# EAGLE design io-hub-stm32 (EAGLE 5.10)
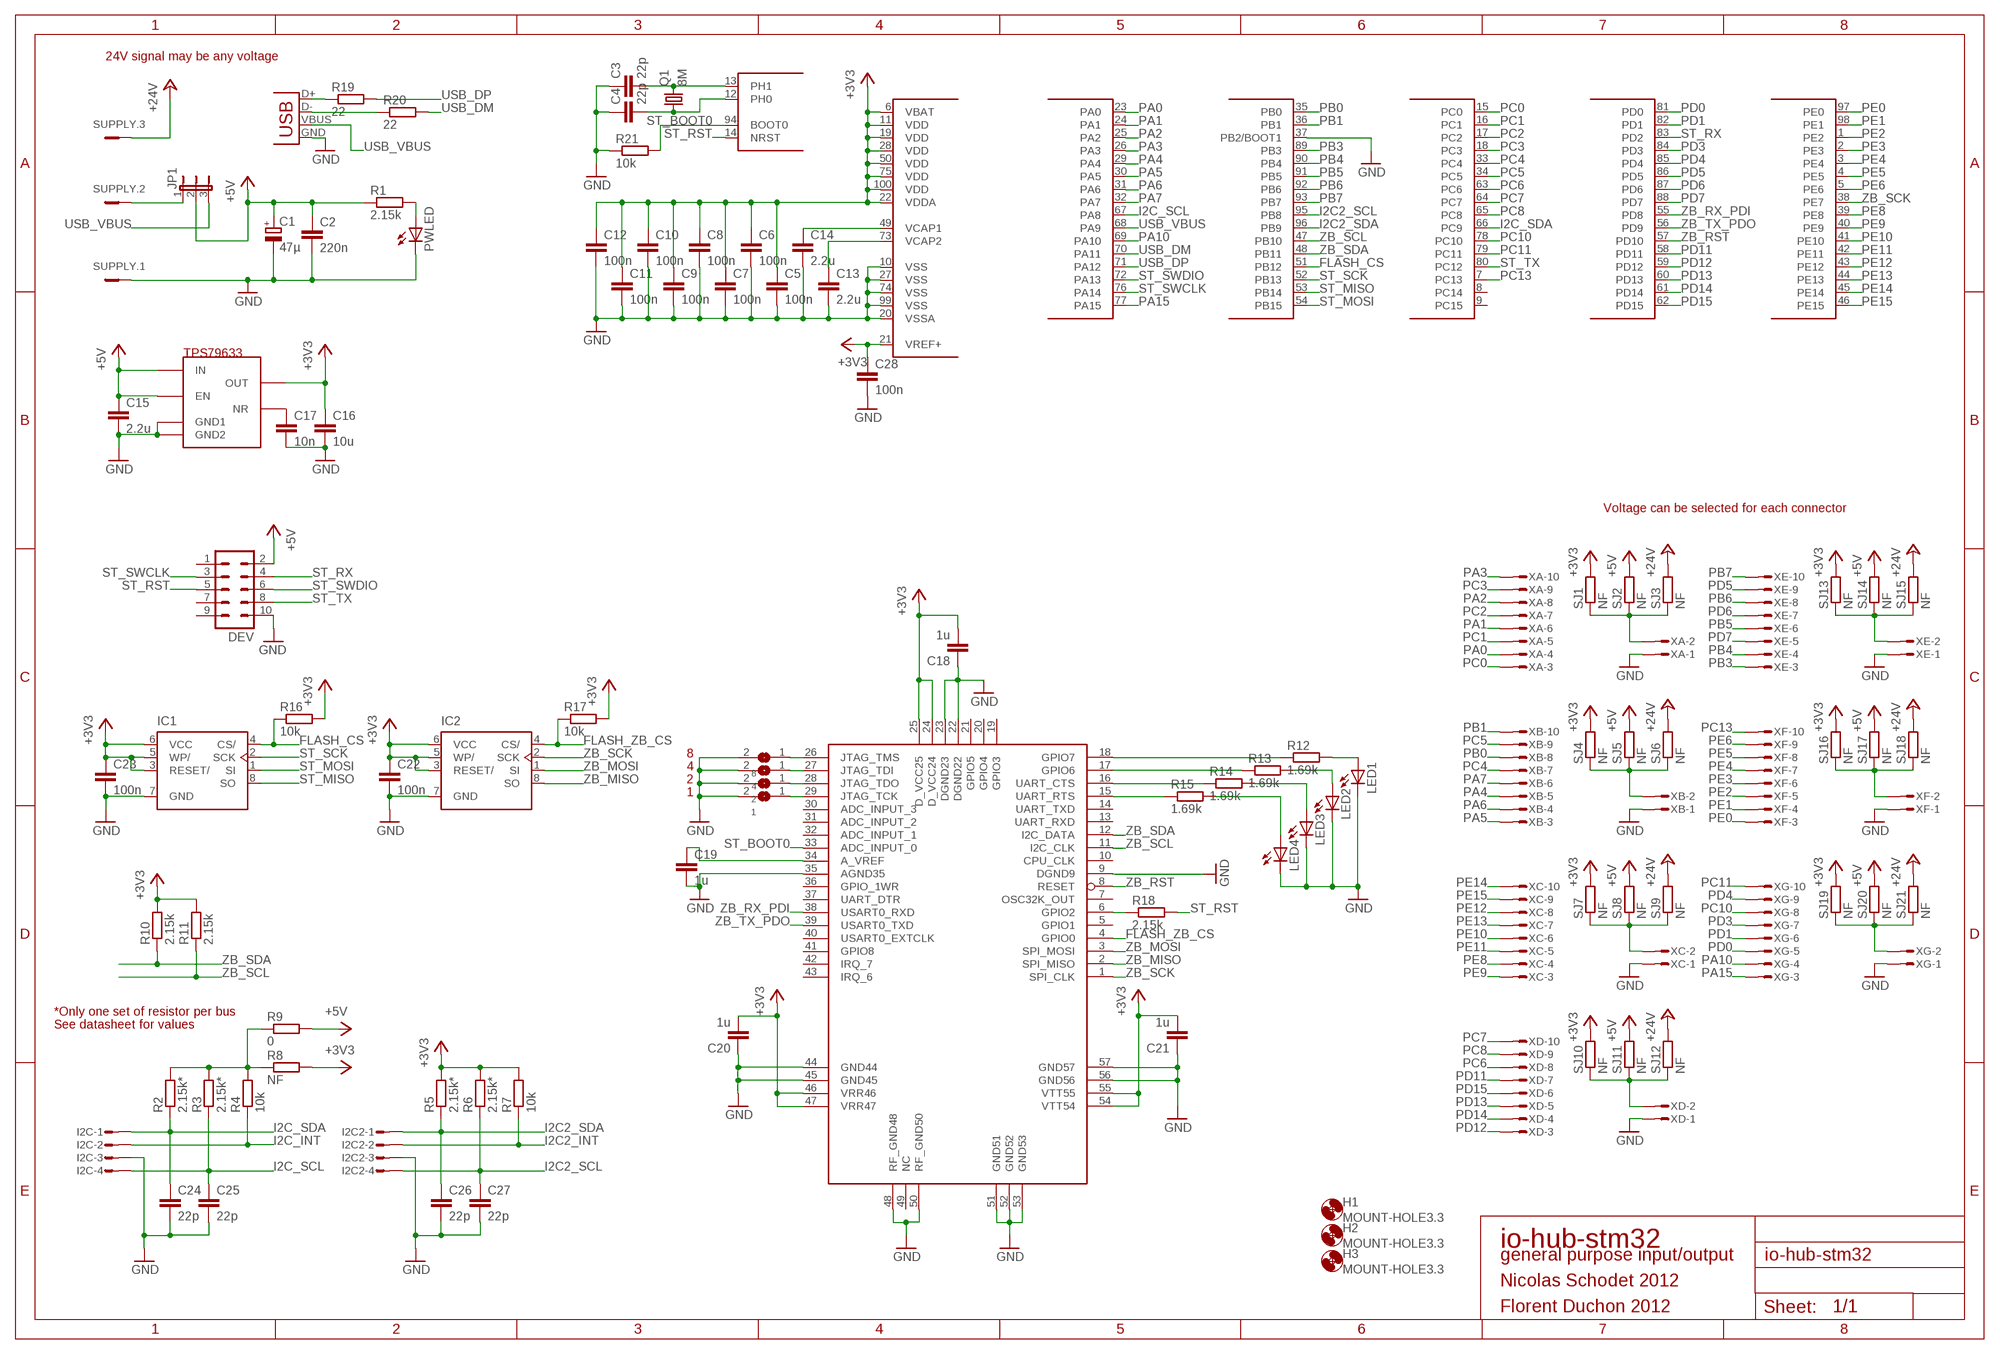
[diagram p0: schematic, sheet 1]

## Parts
1  SJ1SMD  [SJ1-SMD]
2  SJ1SMD  [SJ1-SMD]
4  SJ1SMD  [SJ1-SMD]
8  SJ1SMD  [SJ1-SMD]
C1  47µ  CPOL-EUC  [PANASONIC_C]
C2  220n  C-EUC0603  [C0603]
C3  22p  C-EUC0603  [C0603]
C4  22p  C-EUC0603  [C0603]
C5  100n  C-EUC0603  [C0603]
C6  100n  C-EUC0603  [C0603]
C7  100n  C-EUC0603  [C0603]
C8  100n  C-EUC0603  [C0603]
C9  100n  C-EUC0603  [C0603]
C10  100n  C-EUC0603  [C0603]
C11  100n  C-EUC0603  [C0603]
C12  100n  C-EUC0603  [C0603]
C13  2.2u  C-EUC0603  [C0603]
C14  2.2u  C-EUC0603  [C0603]
C15  2.2u  C-EUC0603  [C0603]
C16  10u  C-EUC0603  [C0603]
C17  10n  C-EUC0603  [C0603]
C18  1u  C-EUC0603  [C0603]
C19  1u  C-EUC0603  [C0603]
C20  1u  C-EUC0603  [C0603]
C21  1u  C-EUC0603  [C0603]
C22  100n  C-EUC0603  [C0603]
C23  100n  C-EUC0603  [C0603]
C24  22p  C-EUC0603  [C0603]
C25  22p  C-EUC0603  [C0603]
C26  22p  C-EUC0603  [C0603]
C27  22p  C-EUC0603  [C0603]
C28  100n  C-EUC0603  [C0603]
DEV  ML10L  [ML10L]
H1  MOUNT-HOLE3.3  [3,3]
H2  MOUNT-HOLE3.3  [3,3]
H3  MOUNT-HOLE3.3  [3,3]
I2C  MICROMATCH-4-SIDE  [MICROMATCH-4-SIDE]
I2C2  MICROMATCH-4-SIDE  [MICROMATCH-4-SIDE]
IC1  AT45DB  [SOIC8]
IC2  AT45DB  [SOIC8]
JP1  JP2E  [JP2]
LED1  LEDSMT1206  [1206]
LED2  LEDSMT1206  [1206]
LED3  LEDSMT1206  [1206]
LED4  LEDSMT1206  [1206]
PWLED  LEDSMT1206  [1206]
Q1  8M  QUARTZABM7  [ABM7]
R1  2.15k  R-EU_R0603  [R0603]
R2  2.15k*  R-EU_R0603  [R0603]
R3  2.15k*  R-EU_R0603  [R0603]
R4  10k  R-EU_R0603  [R0603]
R5  2.15k*  R-EU_R0603  [R0603]
R6  2.15k*  R-EU_R0603  [R0603]
R7  10k  R-EU_R0603  [R0603]
R8  NF  R-EU_R0603  [R0603]
R9  0  R-EU_R0603  [R0603]
R10  2.15k  R-EU_R0603  [R0603]
R11  2.15k  R-EU_R0603  [R0603]
R12  1.69k  R-EU_R0603  [R0603]
R13  1.69k  R-EU_R0603  [R0603]
R14  1.69k  R-EU_R0603  [R0603]
R15  1.69k  R-EU_R0603  [R0603]
R16  10k  R-EU_R0603  [R0603]
R17  10k  R-EU_R0603  [R0603]
R18  2.15k  R-EU_R0603  [R0603]
R19  22  R-EU_R0603  [R0603]
R20  22  R-EU_R0603  [R0603]
R21  10k  R-EU_R0603  [R0603]
SJ1  NF  R-EU_R0603  [R0603]
SJ2  NF  R-EU_R0603  [R0603]
SJ3  NF  R-EU_R0603  [R0603]
SJ4  NF  R-EU_R0603  [R0603]
SJ5  NF  R-EU_R0603  [R0603]
SJ6  NF  R-EU_R0603  [R0603]
SJ7  NF  R-EU_R0603  [R0603]
SJ8  NF  R-EU_R0603  [R0603]
SJ9  NF  R-EU_R0603  [R0603]
SJ10  NF  R-EU_R0603  [R0603]
SJ11  NF  R-EU_R0603  [R0603]
SJ12  NF  R-EU_R0603  [R0603]
SJ13  NF  R-EU_R0603  [R0603]
SJ14  NF  R-EU_R0603  [R0603]
SJ15  NF  R-EU_R0603  [R0603]
SJ16  NF  R-EU_R0603  [R0603]
SJ17  NF  R-EU_R0603  [R0603]
SJ18  NF  R-EU_R0603  [R0603]
SJ19  NF  R-EU_R0603  [R0603]
SJ20  NF  R-EU_R0603  [R0603]
SJ21  NF  R-EU_R0603  [R0603]
SUPPLY  MC3  [MC3]
U1  STM32F4-100-8MIL  [SQFP-S-14X14-100-8MIL]
U2  TPS79633  [SOT223-5]
U3  ATZB-24-UFLR  [ATZB-A24-UFLR]
USB  USB-MICROB-S  [USB-MICROB]
XA  MICROMATCH-10  [MICROMATCH-10]
XB  MICROMATCH-10  [MICROMATCH-10]
XC  MICROMATCH-10  [MICROMATCH-10]
XD  MICROMATCH-10  [MICROMATCH-10]
XE  MICROMATCH-10  [MICROMATCH-10]
XF  MICROMATCH-10  [MICROMATCH-10]
XG  MICROMATCH-10  [MICROMATCH-10]

## Nets
+3V3: C5.1 C6.1 C7.1 C8.1 C9.1 C10.1 C11.1 C12.1 C16.1 C18.2 C20.2 C21.2 C22.1 C23.1 C28.1 IC1.3(RESET/) IC1.5(WP/) IC1.6(VCC) IC2.3(RESET/) IC2.5(WP/) IC2.6(VCC) R5.2 R6.2 R7.2 R8.2 R10.2 R11.2 R16.2 R17.2 SJ1.2 SJ4.2 SJ7.2 SJ10.2 SJ13.2 SJ16.2 SJ19.2 U1.6(VBAT) U1.11(VDD) U1.19(VDD) U1.21(VREF+) U1.22(VDDA) U1.28(VDD) U1.50(VDD) U1.75(VDD) U1.100(VDD) U2.4(OUT) U3.24(D_VCC24) U3.25(D_VCC25) U3.46(VRR46) U3.47(VRR47) U3.54(VTT54) U3.55(VTT55)
+5V [supply]: C1.+ C2.1 C15.1 DEV.2 JP1.2 R1.1 R9.2 SJ2.2 SJ5.2 SJ8.2 SJ11.2 SJ14.2 SJ17.2 SJ20.2 U2.1(EN) U2.2(IN)
+24V: SJ3.2 SJ6.2 SJ9.2 SJ12.2 SJ15.2 SJ18.2 SJ21.2 SUPPLY.3
FLASH_CS: IC1.4(CS/) R16.1 U1.51(PB12)
FLASH_ZB_CS: IC2.4(CS/) R17.1 U3.4(GPIO0)
GND [supply]: 1.2 2.2 4.2 8.2 C1.- C2.2 C3.1 C4.1 C5.2 C6.2 C7.2 C8.2 C9.2 C10.2 C11.2 C12.2 C13.2 C14.2 C15.2 C16.2 C17.2 C18.1 C19.2 C20.1 C21.1 C22.2 C23.2 C24.2 C25.2 C26.2 C27.2 C28.2 DEV.10 I2C2.3 I2C.3 IC1.7(GND) IC2.7(GND) LED1.C LED2.C LED3.C LED4.C PWLED.C R21.1 SUPPLY.1 U1.10(VSS) U1.20(VSSA) U1.27(VSS) U1.37(PB2/BOOT1) U1.74(VSS) U1.99(VSS) U2.3(GND1) U2.6(GND2) U3.9(DGND9) U3.22(DGND22) U3.23(DGND23) U3.35(AGND35) U3.44(GND44) U3.45(GND45) U3.48(RF_GND48) U3.50(RF_GND50) U3.51(GND51) U3.52(GND52) U3.53(GND53) U3.56(GND56) U3.57(GND57) USB.GND XA.1 XB.1 XC.1 XD.1 XE.1 XF.1 XG.1
I2C2_INT: I2C2.2 R7.1
I2C2_SCL: C27.1 I2C2.4 R6.1 U1.95(PB8)
I2C2_SDA: C26.1 I2C2.1 R5.1 U1.96(PB9)
I2C_INT: I2C.2 R4.1
I2C_SCL: C25.1 I2C.4 R3.1 U1.67(PA8)
I2C_SDA: C24.1 I2C.1 R2.1 U1.66(PC9)
N$1: 8.1 U3.26(JTAG_TMS)
N$2: 4.1 U3.27(JTAG_TDI)
N$3: 2.1 U3.28(JTAG_TDO)
N$4: 1.1 U3.29(JTAG_TCK)
N$8: R2.2 R3.2 R4.2 R8.1 R9.1
NPWLED: PWLED.A R1.2
OSC_IN: C4.2 Q1.1 U1.12(PH0)
OSC_OUT: C3.2 Q1.2 U1.13(PH1)
PA0: U1.23(PA0) XA.4
PA1: U1.24(PA1) XA.6
PA2: U1.25(PA2) XA.8
PA3: U1.26(PA3) XA.10
PA4: U1.29(PA4) XB.5
PA5: U1.30(PA5) XB.3
PA6: U1.31(PA6) XB.4
PA7: U1.32(PA7) XB.6
PA10: U1.69(PA10) XG.4
PA15: U1.77(PA15) XG.3
PB0: U1.35(PB0) XB.8
PB1: U1.36(PB1) XB.10
PB3: U1.89(PB3) XE.3
PB4: U1.90(PB4) XE.4
PB5: U1.91(PB5) XE.6
PB6: U1.92(PB6) XE.8
PB7: U1.93(PB7) XE.10
PC0: U1.15(PC0) XA.3
PC1: U1.16(PC1) XA.5
PC2: U1.17(PC2) XA.7
PC3: U1.18(PC3) XA.9
PC4: U1.33(PC4) XB.7
PC5: U1.34(PC5) XB.9
PC6: U1.63(PC6) XD.8
PC7: U1.64(PC7) XD.10
PC8: U1.65(PC8) XD.9
PC10: U1.78(PC10) XG.8
PC11: U1.79(PC11) XG.10
PC13: U1.7(PC13) XF.10
PD0: U1.81(PD0) XG.5
PD1: U1.82(PD1) XG.6
PD3: U1.84(PD3) XG.7
PD4: U1.85(PD4) XG.9
PD5: U1.86(PD5) XE.9
PD6: U1.87(PD6) XE.7
PD7: U1.88(PD7) XE.5
PD11: U1.58(PD11) XD.7
PD12: U1.59(PD12) XD.3
PD13: U1.60(PD13) XD.5
PD14: U1.61(PD14) XD.4
PD15: U1.62(PD15) XD.6
PE0: U1.97(PE0) XF.3
PE1: U1.98(PE1) XF.4
PE2: U1.1(PE2) XF.5
PE3: U1.2(PE3) XF.6
PE4: U1.3(PE4) XF.7
PE5: U1.4(PE5) XF.8
PE6: U1.5(PE6) XF.9
PE8: U1.39(PE8) XC.4
PE9: U1.40(PE9) XC.3
PE10: U1.41(PE10) XC.6
PE11: U1.42(PE11) XC.5
PE12: U1.43(PE12) XC.8
PE13: U1.44(PE13) XC.7
PE14: U1.45(PE14) XC.10
PE15: U1.46(PE15) XC.9
ST_BOOT0: R21.2 U1.94(BOOT0) U3.33(ADC_INPUT_0)
ST_MISO: IC1.8(SO) U1.53(PB14)
ST_MOSI: IC1.1(SI) U1.54(PB15)
ST_RST: DEV.5 R18.2 U1.14(NRST)
ST_RX: DEV.4 U1.83(PD2)
ST_SCK: IC1.2(SCK) U1.52(PB13)
ST_SWCLK: DEV.3 U1.76(PA14)
ST_SWDIO: DEV.6 U1.72(PA13)
ST_TX: DEV.8 U1.80(PC12)
TO_ST_RST: R18.1 U3.6(GPIO2)
USB_DM: R20.2 U1.70(PA11)
USB_DMX: R20.1 USB.D-
USB_DP: R19.2 U1.71(PA12)
USB_DPX: R19.1 USB.D+
USB_VBUS: JP1.3 U1.68(PA9) USB.VBUS
VCAP1: C14.1 U1.49(VCAP1)
VCAP2: C13.1 U1.73(VCAP2)
VREG_NR: C17.1 U2.5(NR)
X5V: JP1.1 SUPPLY.2
XP1: SJ1.1 SJ2.1 SJ3.1 XA.2
XP2: SJ4.1 SJ5.1 SJ6.1 XB.2
XP3: SJ7.1 SJ8.1 SJ9.1 XC.2
XP4: SJ10.1 SJ11.1 SJ12.1 XD.2
XP5: SJ16.1 SJ17.1 SJ18.1 XF.2
XP6: SJ13.1 SJ14.1 SJ15.1 XE.2
XP7: SJ19.1 SJ20.1 SJ21.1 XG.2
ZB_AREF: C19.1 U3.34(A_VREF)
ZB_LED1: R12.1 U3.18(GPIO7)
ZB_LED1R: LED1.A R12.2
ZB_LED2: R13.1 U3.17(GPIO6)
ZB_LED2R: LED2.A R13.2
ZB_LED3: R14.1 U3.16(UART_CTS)
ZB_LED3R: LED3.A R14.2
ZB_LED4: R15.1 U3.15(UART_RTS)
ZB_LED4R: LED4.A R15.2
ZB_MISO: IC2.8(SO) U3.2(SPI_MISO)
ZB_MOSI: IC2.1(SI) U3.3(SPI_MOSI)
ZB_RST: U1.57(PD10) U3.8(RESET)
ZB_RX_PDI: U1.55(PD8) U3.38(USART0_RXD)
ZB_SCK: IC2.2(SCK) U1.38(PE7) U3.1(SPI_CLK)
ZB_SCL: R11.1 U1.47(PB10) U3.11(I2C_CLK)
ZB_SDA: R10.1 U1.48(PB11) U3.12(I2C_DATA)
ZB_TX_PDO: U1.56(PD9) U3.39(USART0_TXD)
Unconnected: DEV.1 DEV.7 DEV.9 U1.8(PC14) U1.9(PC15) U3.5(GPIO1) U3.7(OSC32K_OUT) U3.10(CPU_CLK) U3.13(UART_RXD) U3.14(UART_TXD) U3.19(GPIO3) U3.20(GPIO4) U3.21(GPIO5) U3.30(ADC_INPUT_3) U3.31(ADC_INPUT_2) U3.32(ADC_INPUT_1) U3.36(GPIO_1WR) U3.37(UART_DTR) U3.40(USART0_EXTCLK) U3.41(GPIO8) U3.42(IRQ_7) U3.43(IRQ_6) U3.49(NC)

## Notes on the sheet
- 24V signal may be any voltage
- Voltage can be selected for each connector
- 8
- 4
- 2
- 1
- *Only one set of resistor per bus
- See datasheet for values
- io-hub-stm32
- general purpose input/output
- Nicolas Schodet 2012
- Florent Duchon 2012

## Library data of the parts
1 2 4 8 = apbteam_jumper:SJ1: Jumper
C1 = rcl:CPOL-EU: POLARIZED CAPACITOR, European symbol
C2-C28 = rcl:C-EU: CAPACITOR, European symbol
DEV = con-harting-ml:ML10: HARTING
H1-H3 = holes:MOUNT-HOLE: MOUNTING HOLE with drill center marker
I2C I2C2 = apbteam_con-amp-micromatch:MICROMATCH-4: MicroMaTch 4
IC1 IC2 = ni-flash:AT45DB: AT45DB Atmel SPI data flash serie
JP1 = jumper:JP2E: JUMPER
LED1-LED4 PWLED = led:LED: LED OSRAM: - CHIPLED LG R971, LG N971, LY N971, LG Q971, LY Q971, LO R971, LY R971 LH N974, LH R974 LS Q976, LO Q976, LY Q976 LO Q996 - Hyper CHIPLED LW Q18S LB Q993, LB Q99A, LB R99A - SideLED LS A670, LO A670, LY A670, LG A670, LP A670 LB A673, LV A673, LT A673, LW A673 LH A674 LY A675 LS A676, LA A676, LO A676, LY A676, LW A676 LS A679, LY A679, LG A679 - Hyper Micro SIDELED® LS Y876, LA Y876, LO Y876, LY Y876 LT Y87S - SmartLED LW L88C, LW L88S LB L89C, LB L89S, LG L890 LS L89K, LO L89K, LY L89K LS L896, LA L896, LO L896, LY L896 - TOPLED LS T670, LO T670, LY T670, LG T670, LP T670 LSG T670, LSP T670, LSY T670, LOP T670, LYG T670 LG T671, LOG T671, LSG T671 LB T673, LV T673, LT T673, LW T673 LH T674 LS T676, LA T676, LO T676, LY T676, LB T676, LH T676, LSB T676, LW T676 LB T67C, LV T67C, LT T67C, LS T67K, LO T67K, LY T67K, LW E67C LS E67B, LA E67B, LO E67B, LY E67B, LB E67C, LV E67C, LT E67C LW T67C LS T679, LY T679, LG T679 LS T770, LO T770, LY T770, LG T770, LP T770 LB T773, LV T773, LT T773, LW T773 LH T774 LS E675, LA E675, LY E675, LS T675 LS T776, LA T776, LO T776, LY T776, LB T776 LHGB T686 LT T68C, LB T68C - Hyper Mini TOPLED® LB M676 - Mini TOPLED Santana® LG M470 LS M47K, LO M47K, LY M47K Source: http://www.osram.convergy.de - LUMILED® LXK2-PW12-R00, LXK2-PW12-S00, LXK2-PW14-U00, LXK2-PW14-V00 LXK2-PM12-R00, LXK2-PM12-S00, LXK2-PM14-U00 LXK2-PE12-Q00, LXK2-PE12-R00, LXK2-PE12-S00, LXK2-PE14-T00, LXK2-PE14-U00 LXK2-PB12-K00, LXK2-PB12-L00, LXK2-PB12-M00, LXK2-PB14-N00, LXK2-PB14-P00, LXK2-PB14-Q00 LXK2-PR12-L00, LXK2-PR12-M00, LXK2-PR14-Q00, LXK2-PR14-R00 LXK2-PD12-Q00, LXK2-PD12-R00, LXK2-PD12-S00 LXK2-PH12-R00, LXK2-PH12-S00 LXK2-PL12-P00, LXK2-PL12-Q00, LXK2-PL12-R00 Source: www.luxeon.com
Q1 = ni-crystal:QUARTZ
R1-R21 SJ1-SJ21 = apbteam_rcl:R-EU_: RESISTOR, European symbol
SUPPLY = con-phoenix-381_l:MC3: Mini-Combicon 3.81mm horizontal 3-polig MC 1,5/3-G-3,81 Artikel-Nr. 1803280
U1 = apbteam_stm32:STM32F4-100: STM32F4, 100 pin package According to STM32F40x datasheet, almost compatible with STM32F4xx, STM32F2xx, some pins must be connected differently, see chapter 2.1.
U2 = zigbit:TPS79633
U3 = apbteam_zigbit:ATZB-24-UFLR: ATZB-24-UFLR Package (External Antenna / UFLR connector) Created by florent@duchon.cc
USB = apbteam_con-usb:USB: USB Connectors
XA XB XC XD XE XF XG = apbteam_con-amp-micromatch:MICROMATCH-10: MicroMaTch 10

## Net classes
1 supply: width 0.254 mm

## Board
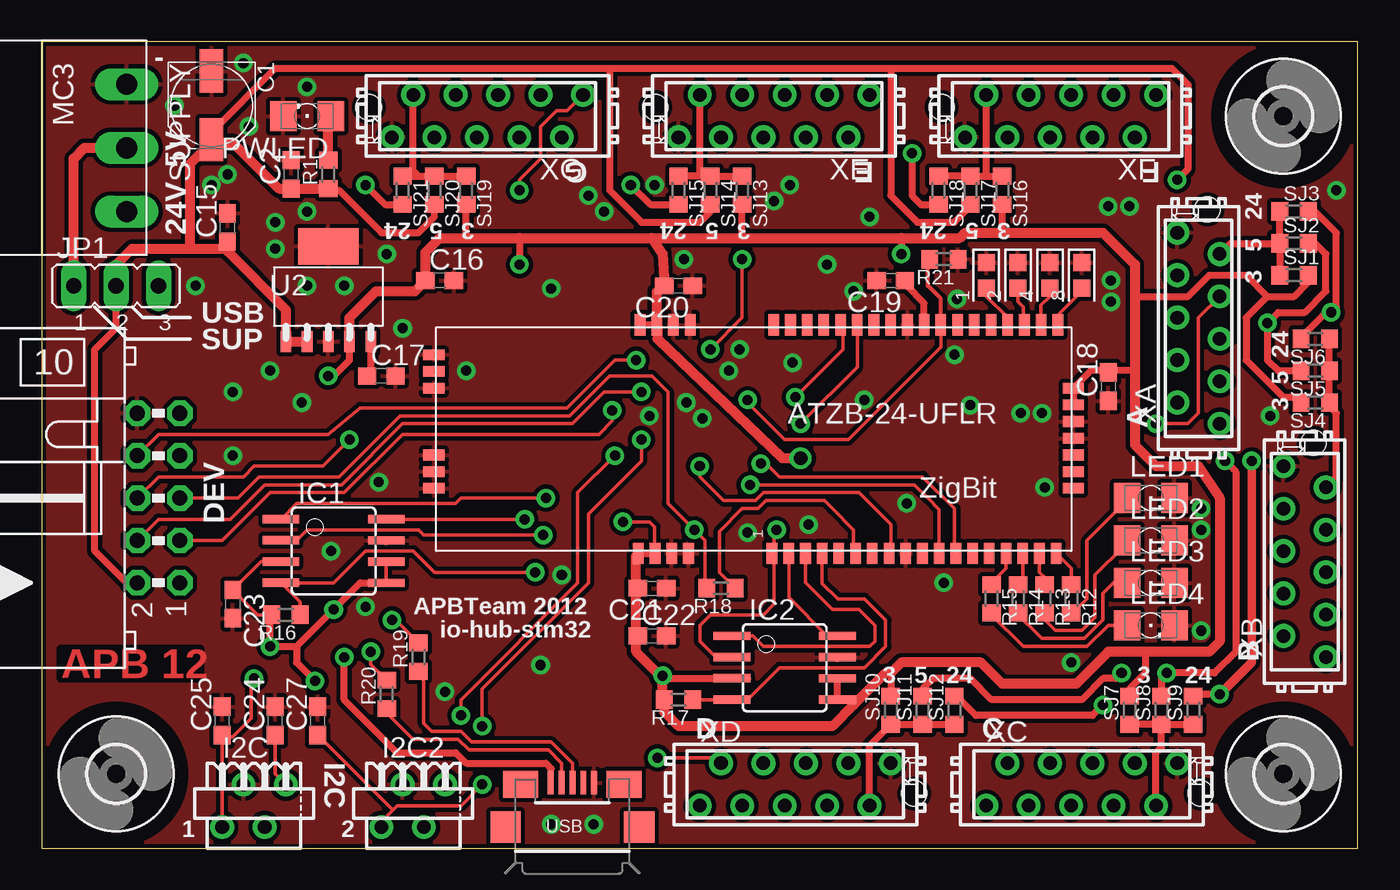
[diagram p1: board, top side]
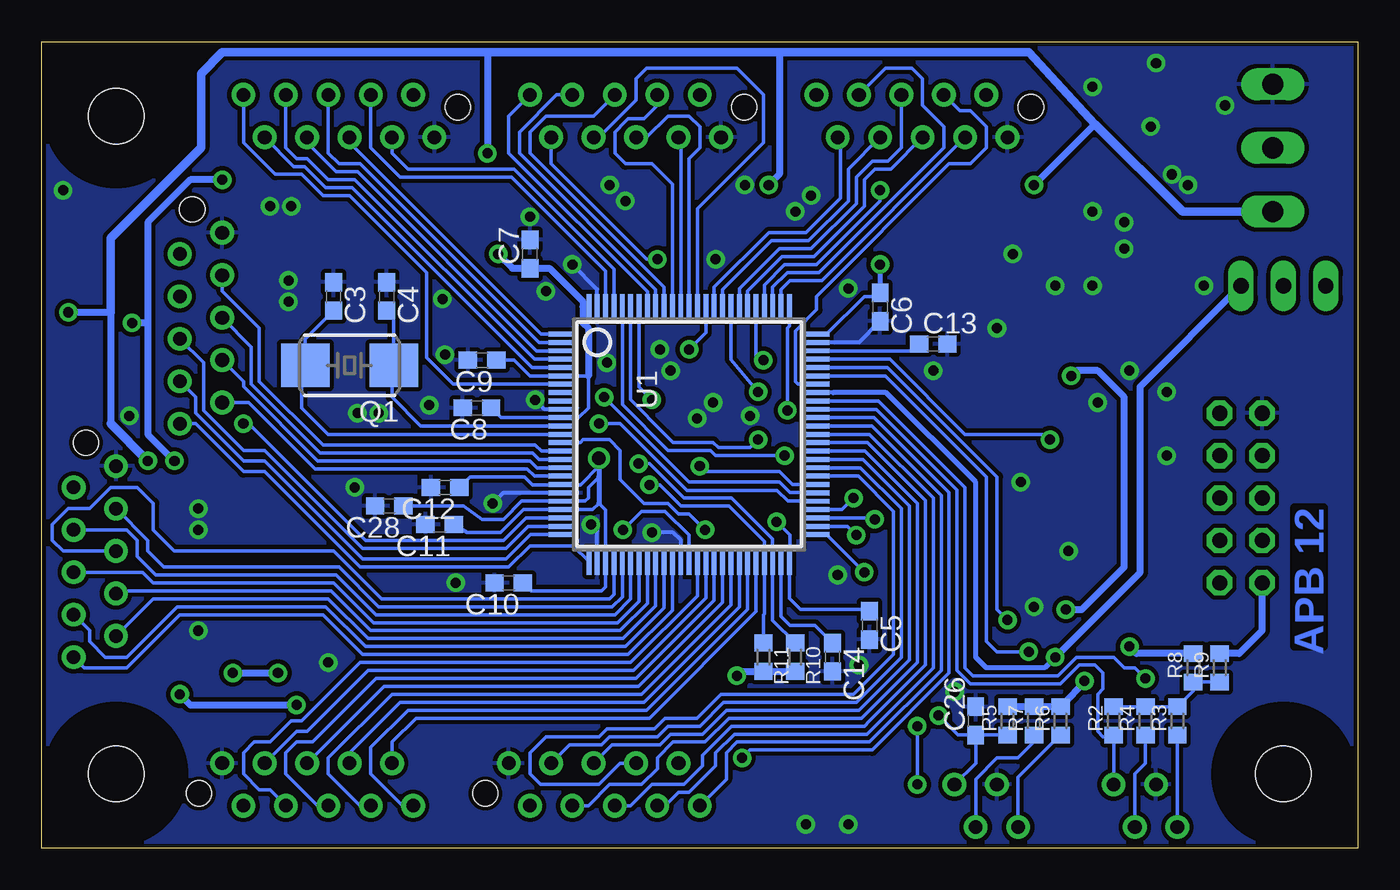
[diagram p2: board, bottom side, seen from below]

Size 78.74 x 48.26 mm. Coordinates in mm from the lower left corner, seen from the top.
Outline: 0,0 78.74,0 78.74,48.26 0,48.26 0,0
Copper layers (1*16): Top 0.035mm / dielectric 1.5mm / Bottom 0.035mm
Design rules "SparkFun": minimum track width 8mil, minimum drill 20mil, track to track 8mil, track to pad 8mil, pad to pad 8mil, via to via 8mil, smd to smd 8mil, copper to edge 10mil, drill to drill 8mil, minimum pad ring 12mil, minimum via ring 10mil, stop-mask expansion 4mil, vias tented up to drill 25mil, thermal gap 10mil

### Footprints (pad centres in the part's own frame; a part is rotated, then mirrored left to right if it is on the bottom)
SJ1-SMD = smd 1.016 x 1.016: 1 0.762,0; 2 -0.762,0
PANASONIC_C = smd 2.6 x 1.4: + 2.05,0; - -2.05,0
C0603 = smd 1.1 x 1: 1 -0.85,0; 2 0.85,0
ML10L = drill 0.914 octagon: 1 -5.08,-1.27; 2 -5.08,1.27; 3 -2.54,-1.27; 4 -2.54,1.27; 5 0,-1.27; 6 0,1.27; 7 2.54,-1.27; 8 2.54,1.27; 9 5.08,-1.27; 10 5.08,1.27
3,3 = hole 3.3: 0,0
MICROMATCH-4-SIDE = drill 0.813 round: 1 1.905,1.27; 2 0.635,-1.27; 3 -0.635,1.27; 4 -1.905,-1.27
SOIC8 = smd 0.5 x 2.2: 1 -1.905,-3.154; 2 -0.645,-3.154; 3 0.625,-3.154; 4 1.895,-3.154; 5 1.905,3.154; 6 0.635,3.154; 7 -0.635,3.154; 8 -1.905,3.154
JP2 = drill 0.914 long: 1 -2.54,0; 2 0,0; 3 2.54,0
1206 = smd 1.6 x 1.803: A -1.422,0; C 1.422,0
ABM7 = smd 2.9 x 2.6: 1 -2.65,0; 2 2.65,0
R0603 = smd 1 x 1.1: 1 -0.85,0; 2 0.85,0
MC3 = drill 1.27 long: 1 -3.81,0; 2 0,0; 3 3.81,0
SQFP-S-14X14-100-8MIL = smd 0.295 x 1.6: 1 -6,-7.6; 2 -5.5,-7.6; 3 -5,-7.6; 4 -4.5,-7.6; 5 -4,-7.6; 6 -3.5,-7.6; 7 -3,-7.6; 8 -2.5,-7.6; 9 -2,-7.6; 10 -1.5,-7.6; 11 -1,-7.6; 12 -0.5,-7.6; 13 0,-7.6; 14 0.5,-7.6; 15 1,-7.6; 16 1.5,-7.6; 17 2,-7.6; 18 2.5,-7.6; 19 3,-7.6; 20 3.5,-7.6; 21 4,-7.6; 22 4.5,-7.6; 23 5,-7.6; 24 5.5,-7.6; 25 6,-7.6; 51 6,7.6; 52 5.5,7.6; 53 5,7.6; 54 4.5,7.6; 55 4,7.6; 56 3.5,7.6; 57 3,7.6; 58 2.5,7.6; 59 2,7.6; 60 1.5,7.6; 61 1,7.6; 62 0.5,7.6; 63 0,7.6; 64 -0.5,7.6; 65 -1,7.6; 66 -1.5,7.6; 67 -2,7.6; 68 -2.5,7.6; 69 -3,7.6; 70 -3.5,7.6; 71 -4,7.6; 72 -4.5,7.6; 73 -5,7.6; 74 -5.5,7.6; 75 -6,7.6 | smd 1.6 x 0.295: 26 7.6,-6; 27 7.6,-5.5; 28 7.6,-5; 29 7.6,-4.5; 30 7.6,-4; 31 7.6,-3.5; 32 7.6,-3; 33 7.6,-2.5; 34 7.6,-2; 35 7.6,-1.5; 36 7.6,-1; 37 7.6,-0.5; 38 7.6,0; 39 7.6,0.5; 40 7.6,1; 41 7.6,1.5; 42 7.6,2; 43 7.6,2.5; 44 7.6,3; 45 7.6,3.5; 46 7.6,4; 47 7.6,4.5; 48 7.6,5; 49 7.6,5.5; 50 7.6,6; 76 -7.6,6; 77 -7.6,5.5; 78 -7.6,5; 79 -7.6,4.5; 80 -7.6,4; 81 -7.6,3.5; 82 -7.6,3; 83 -7.6,2.5; 84 -7.6,2; 85 -7.6,1.5; 86 -7.6,1; 87 -7.6,0.5; 88 -7.6,0; 89 -7.6,-0.5; 90 -7.6,-1; 91 -7.6,-1.5; 92 -7.6,-2; 93 -7.6,-2.5; 94 -7.6,-3; 95 -7.6,-3.5; 96 -7.6,-4; 97 -7.6,-4.5; 98 -7.6,-5; 99 -7.6,-5.5; 100 -7.6,-6
SOT223-5 = smd 0.635 x 1.27: 1 -2.54,-2.7; 2 -1.27,-2.7; 3 0,-2.7; 4 1.27,-2.7; 5 2.54,-2.7 | smd 3.6 x 2.2: 6 0,3
ATZB-A24-UFLR = smd 0.635 x 1.27: 1 17.9,0.135; 2 16.9,0.135; 3 15.9,0.135; 4 14.9,0.135; 5 13.9,0.135; 6 12.9,0.135; 7 11.9,0.135; 8 10.9,0.135; 9 9.9,0.135; 10 8.9,0.135; 11 7.9,0.135; 12 6.9,0.135; 13 5.9,0.135; 14 4.9,0.135; 15 3.9,0.135; 16 2.9,0.135; 17 1.9,0.135; 18 0.9,0.135; 26 0.8,-13.535; 27 1.8,-13.535; 28 2.8,-13.535; 29 3.8,-13.535; 30 4.8,-13.535; 31 5.8,-13.535; 32 6.8,-13.535; 33 7.8,-13.535; 34 8.8,-13.535; 35 9.8,-13.535; 36 10.8,-13.535; 37 11.8,-13.535; 38 12.8,-13.535; 39 13.8,-13.535; 40 14.8,-13.535; 41 15.8,-13.535; 42 16.8,-13.535; 43 17.8,-13.535; 44 22.8,-13.535; 45 23.8,-13.535; 46 24.8,-13.535; 47 25.8,-13.535; 54 25.9,0.135; 55 24.9,0.135; 56 23.9,0.135; 57 22.9,0.135 | smd 1.27 x 0.635: 19 -0.135,-3.75; 20 -0.135,-4.75; 21 -0.135,-5.75; 22 -0.135,-6.75; 23 -0.135,-7.75; 24 -0.135,-8.75; 25 -0.135,-9.75; 48 38.135,-11.75; 49 38.135,-10.75; 50 38.135,-9.75; 51 38.135,-5.75; 52 38.135,-4.75; 53 38.135,-3.75
USB-MICROB = smd 0.35 x 1.4: D+ 0,2.65; D- -0.65,2.65; GND 1.3,2.65; ID 0.65,2.65; VBUS -1.3,2.65 | smd 1.8 x 1.9: MT1 -4,0; MT2 4,0 | smd 2.1 x 1.6: MT3 -3.1,2.55; MT4 3.1,2.55
MICROMATCH-10 = drill 0.813 round: 1 5.715,1.27; 2 4.445,-1.27; 3 3.175,1.27; 4 1.905,-1.27; 5 0.635,1.27; 6 -0.635,-1.27; 7 -1.905,1.27; 8 -3.175,-1.27; 9 -4.445,1.27; 10 -5.715,-1.27 | hole 1.5: 7.11,-0.53

### Placement (x,y rotation side)
1  56.52,34.29 270 top
2  58.42,34.29 270 top
4  60.33,34.29 270 top
8  62.23,34.29 270 top
C1  10.16,44.45 270 top
C2  14.92,40.32 90 top
C3  61.28,33.02 270 bottom
C4  58.1,33.02 270 bottom
C5  29.21,13.34 270 bottom
C6  28.57,32.38 270 bottom
C7  49.53,35.56 90 bottom
C8  52.7,26.35 180 bottom
C9  52.39,29.21 180 bottom
C10  50.8,15.88 180 bottom
C11  54.93,19.37 180 bottom
C12  54.61,21.59 180 bottom
C13  25.4,30.16 0 bottom
C14  31.43,11.43 270 bottom
C15  11.11,37.15 90 top
C16  23.81,33.97 0 top
C17  20.32,28.26 0 top
C18  63.82,27.62 90 top
C19  50.8,33.97 180 top
C20  38.1,33.66 180 top
C21  36.51,15.56 180 top
C22  36.51,12.7 0 top
C23  11.43,14.61 270 top
C24  13.97,7.62 90 top
C25  10.79,7.62 90 top
C26  22.86,7.62 90 bottom
C27  16.51,7.62 90 top
C28  57.94,20.48 180 bottom
DEV  6.99,20.95 90 top
H1  4.45,4.45 0 top
H2  74.3,4.45 0 top
H3  74.3,43.81 0 top
I2C  12.7,2.54 0 top
I2C2  22.23,2.54 0 top
IC1  17.46,17.78 270 top
IC2  44.45,10.79 270 top
JP1  4.45,33.66 0 top
LED1  66.36,20.95 0 top
LED2  66.36,18.41 0 top
LED3  66.36,15.88 0 top
LED4  66.36,13.34 0 top
PWLED  15.88,43.81 180 top
Q1  60.33,28.89 180 bottom
R1  17.14,40.32 90 top
R2  14.61,7.62 90 bottom
R3  10.79,7.62 90 bottom
R4  12.7,7.62 90 bottom
R5  20.95,7.62 90 bottom
R6  17.78,7.62 90 bottom
R7  19.37,7.62 90 bottom
R8  9.84,10.79 90 bottom
R9  8.26,10.79 90 bottom
R10  33.66,11.43 270 bottom
R11  35.56,11.43 270 bottom
R12  61.59,14.92 270 top
R13  60.01,14.92 270 top
R14  58.42,14.92 270 top
R15  56.83,14.92 270 top
R16  14.61,13.97 180 top
R17  38.1,8.89 180 top
R18  40.64,15.56 180 top
R19  22.54,11.43 90 top
R20  20.64,9.21 90 top
R21  53.98,35.24 180 top
SJ1  74.93,34.29 0 top
SJ2  74.93,36.2 0 top
SJ3  74.93,38.1 0 top
SJ4  76.2,26.67 180 top
SJ5  76.2,28.57 180 top
SJ6  76.2,30.48 180 top
SJ7  65.09,8.26 90 top
SJ8  66.99,8.26 90 top
SJ9  68.9,8.26 90 top
SJ10  50.8,8.26 90 top
SJ11  52.7,8.26 90 top
SJ12  54.61,8.26 90 top
SJ13  41.91,39.37 270 top
SJ14  40.01,39.37 270 top
SJ15  38.1,39.37 270 top
SJ16  57.47,39.37 270 top
SJ17  55.56,39.37 270 top
SJ18  53.66,39.37 270 top
SJ19  25.4,39.37 270 top
SJ20  23.5,39.37 270 top
SJ21  21.59,39.37 270 top
SUPPLY  5.08,41.91 270 top
U1  40.01,24.77 270 bottom
U2  17.14,33.02 0 top
U3  61.59,17.78 180 top
USB  31.75,1.27 0 top
XA  69.22,31.11 90 top
XB  75.56,17.14 90 top
XC  62.23,3.81 0 top
XD  45.09,3.81 0 top
XE  43.81,43.81 180 top
XF  60.96,43.81 180 top
XG  26.67,43.81 180 top

### Tracks (layer width: path | path; a pad name or v marks a point on that pad's centre or on a via)
+3V3  (via drill 0.6, 0.8)
  Top 0.203: C20.2 36.8,33.3 | 42.24,10.16 IC2.3 | IC1.5 IC1.6 | R16.2 12.91,13.97 C23.1 13.13,17.16 IC1.3 | 36.67,17.67 36.67,19.21 36.35,19.53 v34.77,19.53
  Top 0.406: U3.46 U3.47 | 28.57,36.51 v28.57,34.92 | 51.44,36.51 v51.44,35.56 | 65.41,28.57 65.4,28.58 63.92,28.58 C18.2 63.71,28.58 62.78,28.58 U3.25 U3.24 | 50.8,10.48 SJ10.2 | IC2.6 IC2.5 48.26,8.89 48.58,8.57 | R17.2 37.15,8.99 37.15,9.21 | U3.55 36.67,17.67 36.65,17.64 U3.54 | SJ1.2 75.78,33.87 74.93,33.02 73.34,33.02 | 73.34,33.02 72.07,34.29 69.85,34.29 68.58,33.02 65.41,33.02 | 73.34,33.02 72.07,31.75 72.07,29.21 74.3,26.99 75.03,26.99 SJ4.2 | R16.2 13.65,13.87 v13.65,12.06 15.24,12.06 | 15.24,12.06 v17.46,14.29 19.05,15.88 IC1.5 | v17.14,28.26 17.46,28.26 18.41,29.21 U2.4 | 15.24,12.06 15.24,11.11 v16.35,10 | 57.47,36.83 SJ16.2 | 41.91,36.51 SJ13.2 | 25.4,36.51 SJ19.2 | SJ7.2 65.09,9.53 66.04,10.48 66.04,11.75 | 37.15,10.16 42.24,10.16
  Top 0.61: 36.8,33.3 U3.46 36.83,31.28 36.83,30.48 44.29,23.34 v45.4,23.34 | U2.4 18.41,31.75 20,33.34 22.33,33.34 C16.1 22.96,35.66 23.81,36.51 25.4,36.51 28.57,36.51 36.51,36.51 | 36.51,36.51 41.91,36.51 51.44,36.51 54.93,36.51 55.24,36.83 57.47,36.83 63.5,36.83 65.41,34.92 65.41,33.02 65.41,28.57 65.41,24.13 66.67,22.86 69.22,22.86 70.48,20.95 70.48,12.38 69.85,11.75 66.04,11.75 63.82,11.75 61.91,9.84 57.47,9.84 56.2,11.11 51.44,11.11 50.8,10.48 50.48,10.48 48.58,8.57 47.31,7.3 38.1,7.3 37.25,8.15 R17.2 | C20.2 37.15,35.56 36.51,36.51 | 37.15,9.21 37.15,10.16 v37.15,10.32 36.99,10.32 35.56,11.75 35.56,12.6 C22.1 35.56,12.7 35.56,15.46 | 35.56,15.46 C21.2 | 35.56,15.46 35.56,17.51 U3.54
  Bottom 0.203: C8.1 51.27,25.77 U1.11 46.62,25.77 46.04,26.35 46.04,28.26 46.05,28.27 U1.6 47.61,28.26 49.53,28.26 50.48,29.21 C9.1 | 47.62,21.75 U1.19 | 45.09,15.56 45.01,15.64 U1.28 45.01,20.24 45.4,20.64 45.77,20.27 U1.22 49.9,20.27 51.28,18.89 53.28,18.89 C11.1 | 45.09,15.56 | 45.09,15.56 45.24,15.4 49.47,15.4 C10.1 | C5.1 29.31,14.29 33.34,14.29 34.01,14.96 U1.50 34.01,18.07 33.97,18.1 33.97,18.73 v34.77,19.53 | U1.100 46.34,32.37 46.35,32.38 | 45.4,22.23 46.04,21.59 46.04,20.95 46.23,20.77 U1.21 50.04,20.77 51.12,19.68 52.39,19.68 53.5,20.48 C28.1 | 47.62,21.75 46.51,21.75 45.4,22.86 | U1.75 31.78,30.77 29.53,33.02 28.79,33.02 C6.1 | 47.62,21.75 49.37,21.75 49.85,22.23 53.12,22.23 C12.1
  Bottom 0.305: 45.4,20.64 45.4,22.23 v45.4,23.34 45.4,22.86 | v28.57,34.92 C6.1
  Bottom 0.406: v51.44,35.56 50.59,34.71 C7.1 48.36,34.71 46.35,32.7 46.35,32.38 46.35,31.43 46.04,31.11 46.04,28.26 | v37.15,10.32 36.89,10.58 R11.2 R10.2 | R8.2 13.23,11.64 v13.65,12.06 | v17.46,14.29 16.51,14.29 13.97,16.83 13.97,26.99 15.56,28.57 16.83,28.57 v17.14,28.26 | v16.35,10 16.19,10.06 R6.2 R7.2 R5.2
+5V  (via drill 0.6)
  Top 0.406: DEV.2 5.08,15.88 3.17,17.78 3.17,29.84 4.45,31.11 JP1.2 | 10.16,42.86 13.97,46.67 33.97,46.67 | 33.97,46.67 50.8,46.67 | 50.8,46.67 67.63,46.67 68.58,45.72 68.58,40.64 v67.94,40.01 | v70.8,23.18 71.44,22.54 71.44,11.75 70.17,10.48 v67.31,10.48 66.99,10.16 66.99,9.84 SJ8.2 | SJ11.2 52.7,9.53 53.34,10.16 55.56,10.16 56.83,8.89 62.23,8.89 63.5,10.16 64.29,10.16 v64.61,10.48 | SJ2.2 76.2,36.2 76.83,35.56 76.83,33.34 75.56,32.07 73.98,32.07 v73.34,31.43 73.34,29.21 73.98,28.57 SJ5.2 | SJ17.2 55.56,38.42 54.61,37.47 52.39,37.47 50.8,39.05 50.8,46.67 | SJ14.2 40.01,38.1 39.37,37.47 35.88,37.47 33.97,39.37 33.97,46.67 | SJ20.2 23.5,37.78 22.54,36.83 20.32,36.83 17.78,39.37 17.25,39.37 R1.1
  Top 0.61: JP1.2 4.45,34.92 5.4,35.88 8.89,35.88 | 8.89,35.88 10.79,35.88 C15.1 11.11,35.72 14.61,32.23 U2.1 U2.2 | C1.+ 10.16,42.23 8.89,40.96 8.89,35.88 | R1.1 C2.1 14.19,39.47 11.43,42.23 10.33,42.23 C1.+ | C1.+ 10.16,42.86
  Bottom 0.406: R9.2 7.09,11.64 5.71,13.02 DEV.2 | 72.39,31.43 72.39,37.47 69.85,40.01 v67.94,40.01 | 72.39,31.43 72.39,24.77 v70.8,23.18 | v67.31,10.48 64.93,10.48 v64.61,10.48 | 72.39,31.43 v73.34,31.43
+24V  (via drill 0.6)
  Top 0.406: v70.48,9.21 69,9.21 SJ9.2 | SJ6.2 75.35,30.58 76.83,32.07 v77.15,32.07 77.47,32.38 77.47,36.83 76.2,38.1 SJ3.2 | SJ18.2 52.6,38.52 52.07,39.05 v52.07,41.59 | SJ15.2 36.41,38.52 v35.24,39.69 | SJ21.2 20.54,38.52 v19.37,39.69 | SJ12.2 54.71,9.11 55.88,7.94 62.87,7.94 v63.5,8.57
  Top 0.508: v72.39,23.18 72.39,11.11 v70.48,9.21
  Bottom 0.406: 74.61,25.4 74.61,32.07 v77.15,32.07 | v63.5,8.57 69.85,8.57 v70.48,9.21 | 52.07,47.62 v52.07,41.59 | v35.24,39.69 34.61,40.32 34.61,47.62 | 15.72,43.34 v19.37,39.69
  Bottom 0.508: SUPPLY.3 10.48,38.1 15.72,43.34 19.68,47.62 34.61,47.62 52.07,47.62 67.94,47.62 69.22,46.35 69.22,41.91 74.61,36.51 74.61,32.07 | 74.61,25.4 v72.39,23.18
FLASH_CS  (via drill 0.6)
  Top 0.203: v29.53,16.51 23.5,16.51 22.23,17.78 19.37,17.78 17.46,15.88 14.32,15.88 IC1.4 15.46,14.74 R16.1
  Bottom 0.203: U1.51 31.78,18.77 v29.53,16.51
FLASH_ZB_CS
  Top 0.203: R17.1 42.24,8.89 | 42.24,8.89 IC2.4 | U3.4 46.7,15.85 47.62,14.92 49.21,14.92 50.48,13.65 50.48,12.06 49.21,10.79 44.14,10.79 42.24,8.89
GND  (via drill 0.6)
  Bottom 0.254: U1.74 29.84,30.27 C6.2 | U1.99 45.51,33.44 v46.99,34.92 | U1.10 48.65,26.27 v49.21,26.83 | U1.37 40.51,18.44 40.96,18.89 v42.23,18.89 | U1.27 45.51,18.99 v45.88,19.37 | U1.20 51.12,21.27 v51.75,20.64
  other vias: 54.61,29.53 60.01,21.59 43.81,38.73 36.67,39.69 41.12,28.57 38.58,26.67 48.58,33.34 53.98,15.88 29.85,10.95 24.13,9.37 38.42,35.24 44.93,29.05 55.56,26.51 20.16,21.91 49.53,37.78 65.09,38.42 54.77,32.86 31.12,16.35 36.35,25.88 61.59,11.11 69.37,13.02 69.37,20.32 58.58,26.04 63.98,32.7 63.98,33.97 63.82,38.42 44.77,39.69 33.66,38.1 32.7,39.05 20.64,35.56 13.97,35.88 13.97,37.47 41.75,29.84 39.53,25.72 30.48,1.43 33.02,1.43 11.43,27.3 13.65,28.57 25.4,28.57 21.59,31.11 12.38,43.18 15.88,45.56 12.06,46.99 7.94,44.45 11.11,40.32 10.16,39.69 19.37,14.45 15.56,26.67 59.85,26.04 69.37,19.05 30.48,33.5 73.5,25.88 77.47,39.37 11.43,23.5 15.88,33.66 18.1,33.66 15.88,38.1 9.21,33.66 17.3,17.78
  pour Top (isolate 0.254): 0,48.26 78.74,48.26 78.74,0 0,0
  pour Bottom (isolate 0.254): 0,48.26 78.74,48.26 78.74,0 0,0
I2C2_INT
  Bottom 0.203: R7.1 19.37,6.35 20.32,5.4 21.59,5.4 22.86,4.13 I2C2.2
I2C2_SCL  (via drill 0.6)
  Top 0.203: v35.88,24.45 35.88,23.18 32.7,20 32.7,15.88 26.35,9.53 v26.35,7.3 | v26.35,3.81 25.08,2.54 21.27,2.54 20.95,2.22 | 20.95,2.22 20.32,1.59 I2C2.4 | C27.1 20.95,2.33 20.95,2.22
  Bottom 0.203: U1.95 43.51,26.84 41.43,24.77 | v26.35,3.81 v26.35,7.3 | R6.1 20.32,4.23 I2C2.4 | 41.43,24.77 | 41.43,24.77 40.96,24.29 38.58,24.29 38.26,23.97 36.35,23.97 v35.88,24.45
I2C2_SDA  (via drill 0.6)
  Top 0.203: v34.29,23.5 32.07,21.27 32.07,15.88 25.08,8.89 v25.08,7.94
  Bottom 0.203: U1.96 44.01,26.54 41.27,23.81 38.73,23.81 38.42,23.5 v34.29,23.5 | v25.08,7.94 23.91,6.77 C26.1 | I2C2.1 22.86,5.08 C26.1 | R5.1 C26.1
I2C_INT
  Bottom 0.203: R4.1 12.7,5.08 13.34,4.45 I2C.2
I2C_SCL  (via drill 0.6)
  Top 0.203: I2C.4 R3.1 10.9,6.67 11.43,6.67 12.54,7.78 12.54,10 v12.7,10.16
  Bottom 0.203: U1.67 28.67,26.77 23.5,21.59 23.5,10.79 23.02,10.32 17.94,10.32 16.83,11.43 14.61,11.43 13.97,10.79 13.34,10.79 v12.7,10.16 12.86,10.32 | I2C.4 R3.1
I2C_SDA
  Top 0.203: C24.1 13.97,4.45 I2C.1
  Bottom 0.203: U1.66 28.8,26.27 23.97,21.43 23.97,10.64 23.18,9.84 17.78,9.84 16.67,10.95 15.72,10.95 15.24,10.48 15.24,9.53 15.56,9.21 15.56,6.99 15.24,6.67 14.71,6.67 R2.1 I2C.1
N$1
  Top 0.203: U3.26 60.8,31.9 62.23,33.34 8.1
N$2
  Top 0.203: U3.27 59.8,32.49 60.33,33.02 4.1
N$3
  Top 0.203: 2.1 58.42,32.7 58.74,32.38 58.74,31.37 U3.28
N$4
  Top 0.203: U3.29 57.8,31.74 56.52,33.02 1.1
N$8
  Bottom 0.203: R2.2 R4.2 R3.2 9.84,9.42 R8.1 R9.1
NPWLED
  Top 0.61: R1.2 17.14,43.66 PWLED.A
OSC_IN
  Bottom 0.203: U1.12 56.06,25.27 57.78,26.99 57.78,28.78 Q1.1 57.67,31.74 C4.2
OSC_OUT
  Bottom 0.203: U1.13 61.59,24.77 63.18,26.35 63.18,28.68 Q1.2 62.98,30.47 C3.2
PA0  (via drill 0.6)
  Top 0.203: XA.4 69.22,31.75 69.22,26.04 68.58,25.4 v66.67,25.4
  Bottom 0.203: U1.23 49.77,19.77 51.12,18.41 59.37,18.41 66.36,25.4 v66.67,25.4
PA1
  Bottom 0.203: U1.24 49.63,19.27 50.96,17.94 59.53,17.94 65.41,23.81 66.67,23.81 69.06,26.19 69.06,29.05 XA.6
PA2
  Bottom 0.203: U1.25 49.5,18.77 50.96,17.3 59.53,17.3 65.41,23.18 66.67,23.18 69.53,26.04 69.53,26.99 XA.8
PA3
  Bottom 0.203: U1.26 46.94,18.1 49.53,18.1 50.8,16.83 59.69,16.83 65.41,22.54 66.67,22.54 69.53,25.4 XA.10
PA4
  Bottom 0.203: U1.29 44.51,15.19 44.77,14.92 58.42,14.92 61.28,17.78 70.8,17.78 72.07,19.05 72.07,20.64 73.03,21.59 74.61,21.59 75.88,20.32 77.15,20.32 78.11,19.37 78.11,18.41 77.47,17.78 XB.5
PA5
  Bottom 0.203: U1.30 44.01,15.05 44.61,14.45 58.58,14.45 60.96,16.83 71.44,16.83 72.39,17.78 72.39,18.41 XB.3
PA6
  Bottom 0.203: U1.31 43.51,14.91 44.45,13.97 58.74,13.97 61.12,16.35 71.91,16.35 73.03,17.46 73.03,18.41 73.66,19.05 XB.4
PA7
  Bottom 0.203: 43.01,14.78 U1.32 | XB.6 72.71,16.51 72.07,15.88 61.28,15.88 58.9,13.49 44.29,13.49 43.01,14.78 | 43.01,14.78
PA10
  Bottom 0.203: U1.69 33.48,27.77 33.66,27.94 33.66,30.96 32.38,32.23 32.38,33.02 24.45,40.96 23.18,40.96 22.23,41.91 22.23,43.18 23.18,44.13 23.81,44.13 XG.4
PA15
  Bottom 0.203: U1.77 34.51,33.44 33.97,33.97 32.07,33.97 XG.3
PB0
  Bottom 0.203: U1.35 41.51,14.38 43.81,12.06 59.37,12.06 61.75,14.45 70.64,14.45 73.66,11.43 74.93,11.43 75.88,12.38 75.88,13.02 XB.8
PB1
  Bottom 0.203: U1.36 41.01,14.24 43.66,11.59 59.53,11.59 61.91,13.97 70.48,13.97 73.66,10.79 76.2,10.79 XB.10
PB3
  Bottom 0.203: U1.89 40.51,42.41 XE.3
PB4
  Bottom 0.203: 43.81,43.5 44.45,42.86 44.45,41.59 43.81,40.96 42.23,40.96 41.01,39.73 U1.90 | 43.81,43.5 | 43.81,43.5 43.66,43.66 42.7,43.66 41.91,44.45 XE.4
PB5
  Bottom 0.203: U1.91 41.51,33.57 49.53,41.59 49.53,42.86 48.58,43.81 45.72,43.81 XE.6
PB6
  Bottom 0.203: U1.92 42.01,33.43 50.16,41.59 50.16,42.86 47.94,45.09 XE.8
PB7
  Bottom 0.203: U1.93 42.51,33.3 50.8,41.59 50.8,43.81 XE.10
PC0
  Bottom 0.203: XA.3 67.94,33.34 65.72,31.11 65.72,27.94 61.91,24.13 49.21,24.13 48.85,23.77 U1.15
PC1
  Bottom 0.203: XA.5 66.2,30 66.2,27.78 62.07,23.65 49.37,23.65 48.98,23.27 U1.16
PC2
  Bottom 0.203: XA.7 66.67,27.94 66.67,27.62 62.23,23.18 49.53,23.18 49.12,22.77 U1.17
PC3
  Bottom 0.203: XA.9 66.36,26.67 62.39,22.7 49.69,22.7 49.25,22.27 U1.18
PC4
  Bottom 0.203: U1.33 42.51,14.64 44.13,13.02 59.05,13.02 61.44,15.4 74.14,15.4 XB.7
PC5
  Bottom 0.203: U1.34 42.01,14.51 43.97,12.54 59.21,12.54 61.59,14.92 72.07,14.92 XB.9
PC6
  Bottom 0.203: U1.63 29.21,24.77 25.4,20.95 25.4,10.79 29.37,6.83 37.31,6.83 38.42,5.71 38.42,4.92 40.01,3.33 40.64,3.33 41.43,2.54 XD.8
PC7
  Bottom 0.203: U1.64 29.07,25.27 24.92,21.11 24.92,10.64 29.21,6.35 37.15,6.35 37.78,5.71 37.78,4.13 XD.10
PC8  (via drill 0.6 pad 0.25)
  Top 0.203: v36.83,5.4 40.32,5.4 XD.9
  Bottom 0.203: U1.65 28.94,25.77 24.45,21.27 24.45,10.48 29.05,5.87 36.35,5.87 v36.83,5.4
PC10
  Bottom 0.203: U1.78 35.01,33.58 34.13,34.45 32.23,34.45 24.77,41.91 24.77,43.18 26.04,44.45 26.04,46.04 26.67,46.67 28.26,46.67 XG.8
PC11  (via drill 0.6)
  Top 0.203: v28.57,39.37 28.57,40.01 29.84,41.27 29.84,43.18 30.8,44.13 31.43,44.13 XG.10
  Bottom 0.203: U1.79 35.51,33.71 34.29,34.92 32.38,34.92 28.57,38.73 v28.57,39.37
PC13
  Bottom 0.203: XF.10 66.67,42.23 64.77,40.32 63.18,40.32 61.91,39.05 60.33,39.05 55.72,34.45 55.72,29.37 54.12,27.77 U1.7
PD0
  Bottom 0.203: U1.81 36.51,33.34 34.45,35.4 32.54,35.4 29.53,38.42 29.53,40.01 28.89,40.64 27.94,40.64 XG.5
PD1
  Bottom 0.203: U1.82 37.01,33.48 34.61,35.88 32.7,35.88 30,38.58 30,40.16 29.05,41.12 28.1,41.12 27.3,41.91 XG.6
PD3
  Bottom 0.203: U1.84 38.01,33.43 35.08,36.35 32.86,36.35 30.48,38.73 30.48,40.64 XG.7
PD4
  Bottom 0.203: U1.85 38.51,33.57 35.24,36.83 33.02,36.83 30.96,38.89 30.96,42.39 XG.9
PD5  (via drill 0.6)
  Top 0.203: v40.01,29.84 41.91,31.75 v41.91,35.24
  Bottom 0.203: U1.86 39.01,30.84 v40.01,29.84 | v41.91,35.24 42.55,35.24 48.26,40.96 XE.9
PD6
  Bottom 0.203: U1.87 39.51,38.28 35.56,42.23 35.56,45.09 37.15,46.67 42.55,46.67 43.18,46.04 43.18,44.77 45.09,42.86 45.4,42.86 XE.7
PD7
  Bottom 0.203: U1.88 40.01,41.27 39.37,41.91 39.37,43.18 40.01,43.81 41.27,43.81 42.55,42.55 XE.5
PD11
  Bottom 0.203: U1.58 29.89,22.27 27.78,20.16 27.78,11.59 30.16,9.21 38.1,9.21 39.53,7.78 41.43,7.78 42.07,7.14 44.93,7.14 45.4,6.67 48.58,6.67 49.53,5.71 49.53,4.45 48.9,3.81 45.4,3.81 44.13,5.08 XD.7
PD12
  Bottom 0.203: U1.59 29.75,22.77 27.3,20.32 27.3,11.43 30,8.73 37.94,8.73 39.37,7.3 41.27,7.3 41.91,6.67 44.77,6.67 45.24,6.19 47.15,6.19 XD.3
PD13
  Bottom 0.203: U1.60 29.61,23.27 26.83,20.48 26.83,11.27 29.84,8.26 37.78,8.26 39.21,6.83 41.12,6.83 41.75,6.19 44.61,6.19 XD.5
PD14
  Bottom 0.203: U1.61 29.48,23.77 26.35,20.64 26.35,11.11 29.69,7.78 37.62,7.78 39.05,6.35 40.96,6.35 41.91,5.4 41.91,4.76 42.86,3.81 44.77,3.81 46.04,2.54 XD.4
PD15
  Bottom 0.203: U1.62 29.34,24.27 25.88,20.8 25.88,10.95 | 29.21,7.62 | 29.21,7.62 29.53,7.3 37.47,7.3 39.21,5.56 39.21,4.92 40.32,3.81 42.23,3.81 43.5,2.54 XD.6 | 25.88,10.95 | 29.21,7.62 25.88,10.95
PE0
  Bottom 0.203: U1.97 44.51,34.66 50.48,40.64 56.83,40.64 57.78,41.59 XF.3
PE1
  Bottom 0.203: U1.98 45.01,34.53 50.64,40.16 57.31,40.16 59.05,41.91 XF.4
PE2
  Bottom 0.203: U1.1 48.88,30.78 60.33,42.23 XF.5
PE3
  Bottom 0.203: U1.2 49,30.27 59.69,40.96 60.96,40.96 61.59,41.59 XF.6
PE4
  Bottom 0.203: U1.3 49.13,29.77 59.85,40.48 61.12,40.48 62.87,42.23 XF.7
PE5
  Bottom 0.203: U1.4 49.27,29.27 60.01,40.01 61.59,40.01 62.87,41.27 63.5,41.27 64.14,41.91 XF.8
PE6
  Bottom 0.203: U1.5 49.4,28.77 60.17,39.53 61.75,39.53 63.02,40.8 63.66,40.8 XF.9
PE8
  Bottom 0.203: U1.39 39.51,15.11 43.5,11.11 59.69,11.11 63.18,7.62 63.82,7.62 65.09,6.35 66.04,6.35 66.67,5.71 66.67,4.45 65.72,3.49 65.09,3.49 XC.4
PE9
  Bottom 0.203: U1.40 39.01,14.97 43.34,10.64 59.21,10.64 62.87,6.99 63.5,6.99 XC.3
PE10
  Bottom 0.203: U1.41 38.51,14.84 43.18,10.16 58.74,10.16 62.55,6.35 63.5,6.35 64.14,5.71 64.14,4.45 62.23,2.54 XC.6
PE11
  Bottom 0.203: U1.42 38.01,14.7 43.02,9.68 58.26,9.68 XC.5
PE12
  Bottom 0.203: U1.43 37.51,14.56 42.86,9.21 57.78,9.21 61.59,5.4 61.59,4.45 59.69,2.54 XC.8
PE13
  Bottom 0.203: U1.44 37.01,14.43 42.7,8.73 57.31,8.73 60.33,5.71 XC.7
PE14
  Bottom 0.203: U1.45 36.51,14.29 42.55,8.26 56.83,8.26 59.05,6.03 59.05,4.45 57.15,2.54 XC.10
PE15
  Bottom 0.203: U1.46 36.01,14.16 42.39,7.78 56.36,7.78 57.78,6.35 XC.9
ST_BOOT0  (via drill 0.6)
  Top 0.203: U3.33 53.8,29.98 48.26,24.45 44.45,24.45 42.23,26.67 v42.23,26.83
  Top 0.254: U3.33 53.8,32.88 53.02,33.66 53.02,34.92 R21.2
  Bottom 0.203: U1.94 43.01,27.61 v42.23,26.83
ST_MISO  (via drill 0.6)
  Top 0.203: IC1.8 v28.89,19.68
  Bottom 0.203: U1.53 28.97,19.77 v28.89,19.68
ST_MOSI  (via drill 0.6)
  Top 0.203: v30.16,20.95 25.08,20.95 24.77,20.64 15.26,20.64 IC1.1
  Bottom 0.203: U1.54 30.85,20.27 v30.16,20.95
ST_RST  (via drill 0.6)
  Top 0.203: DEV.5 11.75,20.95 13.02,22.23 17.78,22.23 21.43,25.88 31.59,25.88 33.97,28.26 36.51,28.26 37.47,27.3 37.47,20.64 v39.05,19.05 39.69,18.41 39.69,15.66 R18.2
  Bottom 0.203: v39.05,19.05 40.01,20 40.64,20 41.27,20.64 42.7,20.64 44.13,22.07 44.13,23.81 44.77,24.45 46.35,24.45 46.51,24.29 47.58,24.29 U1.14
ST_RX  (via drill 0.6)
  Top 0.203: v35.88,27.3 33.66,27.3 31.75,25.4 21.59,25.4 17.94,21.75 13.34,21.75 11.27,19.68 6.99,19.68 DEV.4
  Bottom 0.203: U1.83 37.51,29.25 v35.88,27.3
ST_SCK  (via drill 0.6)
  Top 0.203: v30,18.73 22.86,18.73 22.54,19.05 15.88,19.05 15.24,18.41 14.32,18.41 IC1.2
  Bottom 0.203: U1.52 30.54,19.27 v30,18.73
ST_SWCLK  (via drill 0.6)
  Top 0.203: v34.13,26.19 34.13,25.56 33.34,24.77 21.59,24.77 18.1,21.27 13.65,21.27 10.79,18.41 DEV.3
  Bottom 0.203: U1.76 34.01,31.24 34.13,31.11 v34.13,26.19
ST_SWDIO  (via drill 0.6)
  Top 0.203: v18.41,24.45 16.83,22.86 12.7,22.86 12.06,22.23 6.99,22.23 DEV.6
  Bottom 0.203: U1.72 28,29.27 23.5,24.77 18.73,24.77 v18.41,24.45
ST_TX  (via drill 0.6)
  Top 0.203: v35.56,29.21 34.29,29.21 31.43,26.35 19.05,26.35 17.14,24.77 6.99,24.77 DEV.8
  Bottom 0.203: U1.80 36.01,29.34 v35.56,29.21
TO_ST_RST
  Top 0.203: U3.6 48.58,17.76 48.58,19.05 47.31,20.32 46.83,20.8 43.34,20.8 42.86,20.32 41.91,20.32 40.54,18.95 40.54,16.51 R18.1
USB_DM  (via drill 0.6)
  Top 0.203: R20.2 19.68,11.01 v19.68,11.75
  Bottom 0.203: U1.70 28.27,28.27 22.23,22.23 22.23,12.38 21.59,11.75 v19.68,11.75
USB_DMX
  Top 0.203: USB.D- 31.11,4.25 31.11,5.08 30.32,5.87 25.56,5.87 24.92,6.51 22.23,6.51 20.64,8.1 R20.1
USB_DP  (via drill 0.6)
  Top 0.203: R19.2 21.17,13.65 v20.95,13.65
  Bottom 0.203: U1.71 28.13,28.77 21.59,22.23 21.59,14.29 v20.95,13.65
USB_DPX
  Top 0.203: USB.D+ 31.75,5.08 30.48,6.35 25.72,6.35 25.08,6.99 23.34,6.99 22.86,7.46 22.86,10.26 R19.1
USB_VBUS  (via drill 0.6)
  Top 0.203: 30.48,4.76 30.48,3.95 USB.VBUS
  Top 0.406: v18.1,11.43 18.1,8.89 21.27,5.71 24.77,5.71 25.4,5.08 30.16,5.08 30.48,4.76
  Bottom 0.254: 31.39,27.27 U1.68
  Bottom 0.305: v18.1,11.43 18.73,10.79 22.23,10.79 22.86,11.43 22.86,21.91 28.22,27.27 31.39,27.27
  Bottom 0.406: JP1.3 13.02,27.62 13.02,16.51 v18.1,11.43
VCAP1
  Bottom 0.203: U1.49 34.51,13.87 33.97,13.34 32.49,13.34 C14.1
VCAP2
  Bottom 0.203: U1.73 26.65,29.77 C13.1
VREG_NR
  Top 0.406: U2.5 19.68,28.47 C17.1
X5V
  Top 0.61: JP1.1 1.91,41.27 2.54,41.91 SUPPLY.2
XP1
  Top 0.406: SJ2.1 SJ1.1 | SJ2.1 SJ3.1 | SJ2.1 71.12,36.2 XA.2
XP2
  Top 0.406: XB.2 77.47,22.23 77.47,26.04 77.05,26.45 SJ4.1 SJ5.1 SJ6.1
XP3
  Top 0.406: SJ8.1 SJ7.1 | SJ8.1 SJ9.1 | SJ8.1 66.99,6.03 66.67,5.71 XC.2
XP4
  Top 0.406: XD.2 49.53,6.13 SJ10.1 SJ11.1 SJ12.1
XP5
  Top 0.406: 56.52,40.22 SJ17.1 SJ18.1 | 56.52,40.22 SJ16.1 | 56.52,40.22 XF.2
XP6
  Top 0.406: XE.2 39.37,40.32 39.9,40.32 SJ14.1 | SJ14.1 SJ15.1 | SJ14.1 SJ13.1
XP7
  Top 0.406: SJ21.1 22.54,40.22 | 22.54,40.22 SJ20.1 SJ19.1 | XG.2 22.23,40.54 22.54,40.22
ZB_AREF
  Top 0.406: U3.34 52.8,32.61 51.75,33.66 C19.1
ZB_LED1
  Top 0.203: U3.18 61.59,16.75 R12.1
ZB_LED1R
  Top 0.203: R12.2 61.7,14.07 62.55,14.92 62.55,18.41 65.09,20.95 LED1.A
ZB_LED2
  Top 0.203: U3.17 59.69,16.51 60.01,16.19 R13.1
ZB_LED2R
  Top 0.203: R13.2 60.01,13.65 60.64,13.02 62.23,13.02 63.02,13.81 63.02,16.35 64.77,18.1 LED2.A
ZB_LED3
  Top 0.203: U3.16 58.7,16.05 R14.1
ZB_LED3R
  Top 0.203: R14.2 58.42,13.97 59.69,12.7 | 59.69,12.7 | 59.69,12.7 59.85,12.54 62.39,12.54 63.5,13.65 63.5,15.24 64.45,16.19 64.62,16.19 LED3.A
ZB_LED4
  Top 0.203: U3.15 57.7,16.74 57.15,16.19 57.15,16.09 R15.1
ZB_LED4R
  Top 0.203: R15.2 56.83,13.97 58.74,12.06 62.55,12.06 63.82,13.34 LED4.A
ZB_MISO
  Top 0.203: U3.2 44.7,14.99 46.99,12.7 IC2.8
ZB_MOSI
  Top 0.203: U3.3 45.7,15.9 47.31,14.29 48.9,14.29 49.85,13.34 49.85,12.38 49.53,12.06 43.18,12.06 42.55,12.7 IC2.1
ZB_RST  (via drill 0.6)
  Top 0.203: v39.37,22.86 39.37,22.23 40.64,20.95 40.8,20.8 42.7,20.8 43.18,21.27 48.9,21.27 50.8,19.37 50.8,17.75
  Top 0.305: 50.8,17.75 U3.8
  Bottom 0.203: U1.57 33.83,21.77 34.61,22.54 39.05,22.54 v39.37,22.86
ZB_RX_PDI  (via drill 0.6)
  Top 0.203: U3.38 48.8,28.79 v45.4,25.4
  Bottom 0.203: v45.4,25.4 44.13,25.4 40.13,21.4 34.73,21.4 34.1,20.77 U1.55
ZB_SCK  (via drill 0.6)
  Top 0.203: IC2.2 40.31,11.44 39.37,12.38 39.37,13.34 40.01,13.97 43.18,13.97 43.81,14.61 43.81,17.52 U3.1 43.81,17.77 43.81,18.89 v43.97,19.05
  Bottom 0.203: U1.38 40.01,18.73 41.43,20.16 42.86,20.16 v43.97,19.05
ZB_SCL  (via drill 0.6)
  Top 0.203: U3.11 53.7,20.28 53.02,20.95 | 53.02,20.95 | 53.02,20.95 52.23,21.75 42.55,21.75 v42.39,21.75
  Bottom 0.203: R11.1 35.56,13.97 35.51,14.03 U1.47 35.51,18.36 37.62,20.48 40.48,20.48 41.75,21.75 42.23,21.75 v42.39,21.75
ZB_SDA  (via drill 0.6)
  Top 0.203: U3.12 54.61,17.73 54.61,20.32 52.7,22.23 44.13,22.23 43.34,23.02 v43.02,23.02
  Bottom 0.203: R10.1 35.01,13.63 U1.48 35.01,18.5 37.47,20.95 40.32,20.95 42.39,23.02 v43.02,23.02
ZB_TX_PDO  (via drill 0.6)
  Top 0.203: v45.09,26.99 47.94,29.84 47.94,31.17
  Top 0.305: 47.94,31.17 U3.39
  Bottom 0.203: v45.09,26.99 40.01,21.91 34.61,21.91 33.97,21.27 U1.56

### Text on the board
Top: APB 12
Bottom: APB 12
tSilk: - | 5V | G | E | F | 24V | 24 | 24 | 5 | 3 | 24 | 5 | 3 | 24 | 5 | 3 | 5 | 3 | USB | SUP | 24 | 5 | 3 | A | DEV | APBTeam 2012 | io-hub-stm32 | B | 3 | 5 | 24 | 3 | 24 | D | C | I2C | 1 | 2